# EAGLE design Power supply (EAGLE 9.6.2)
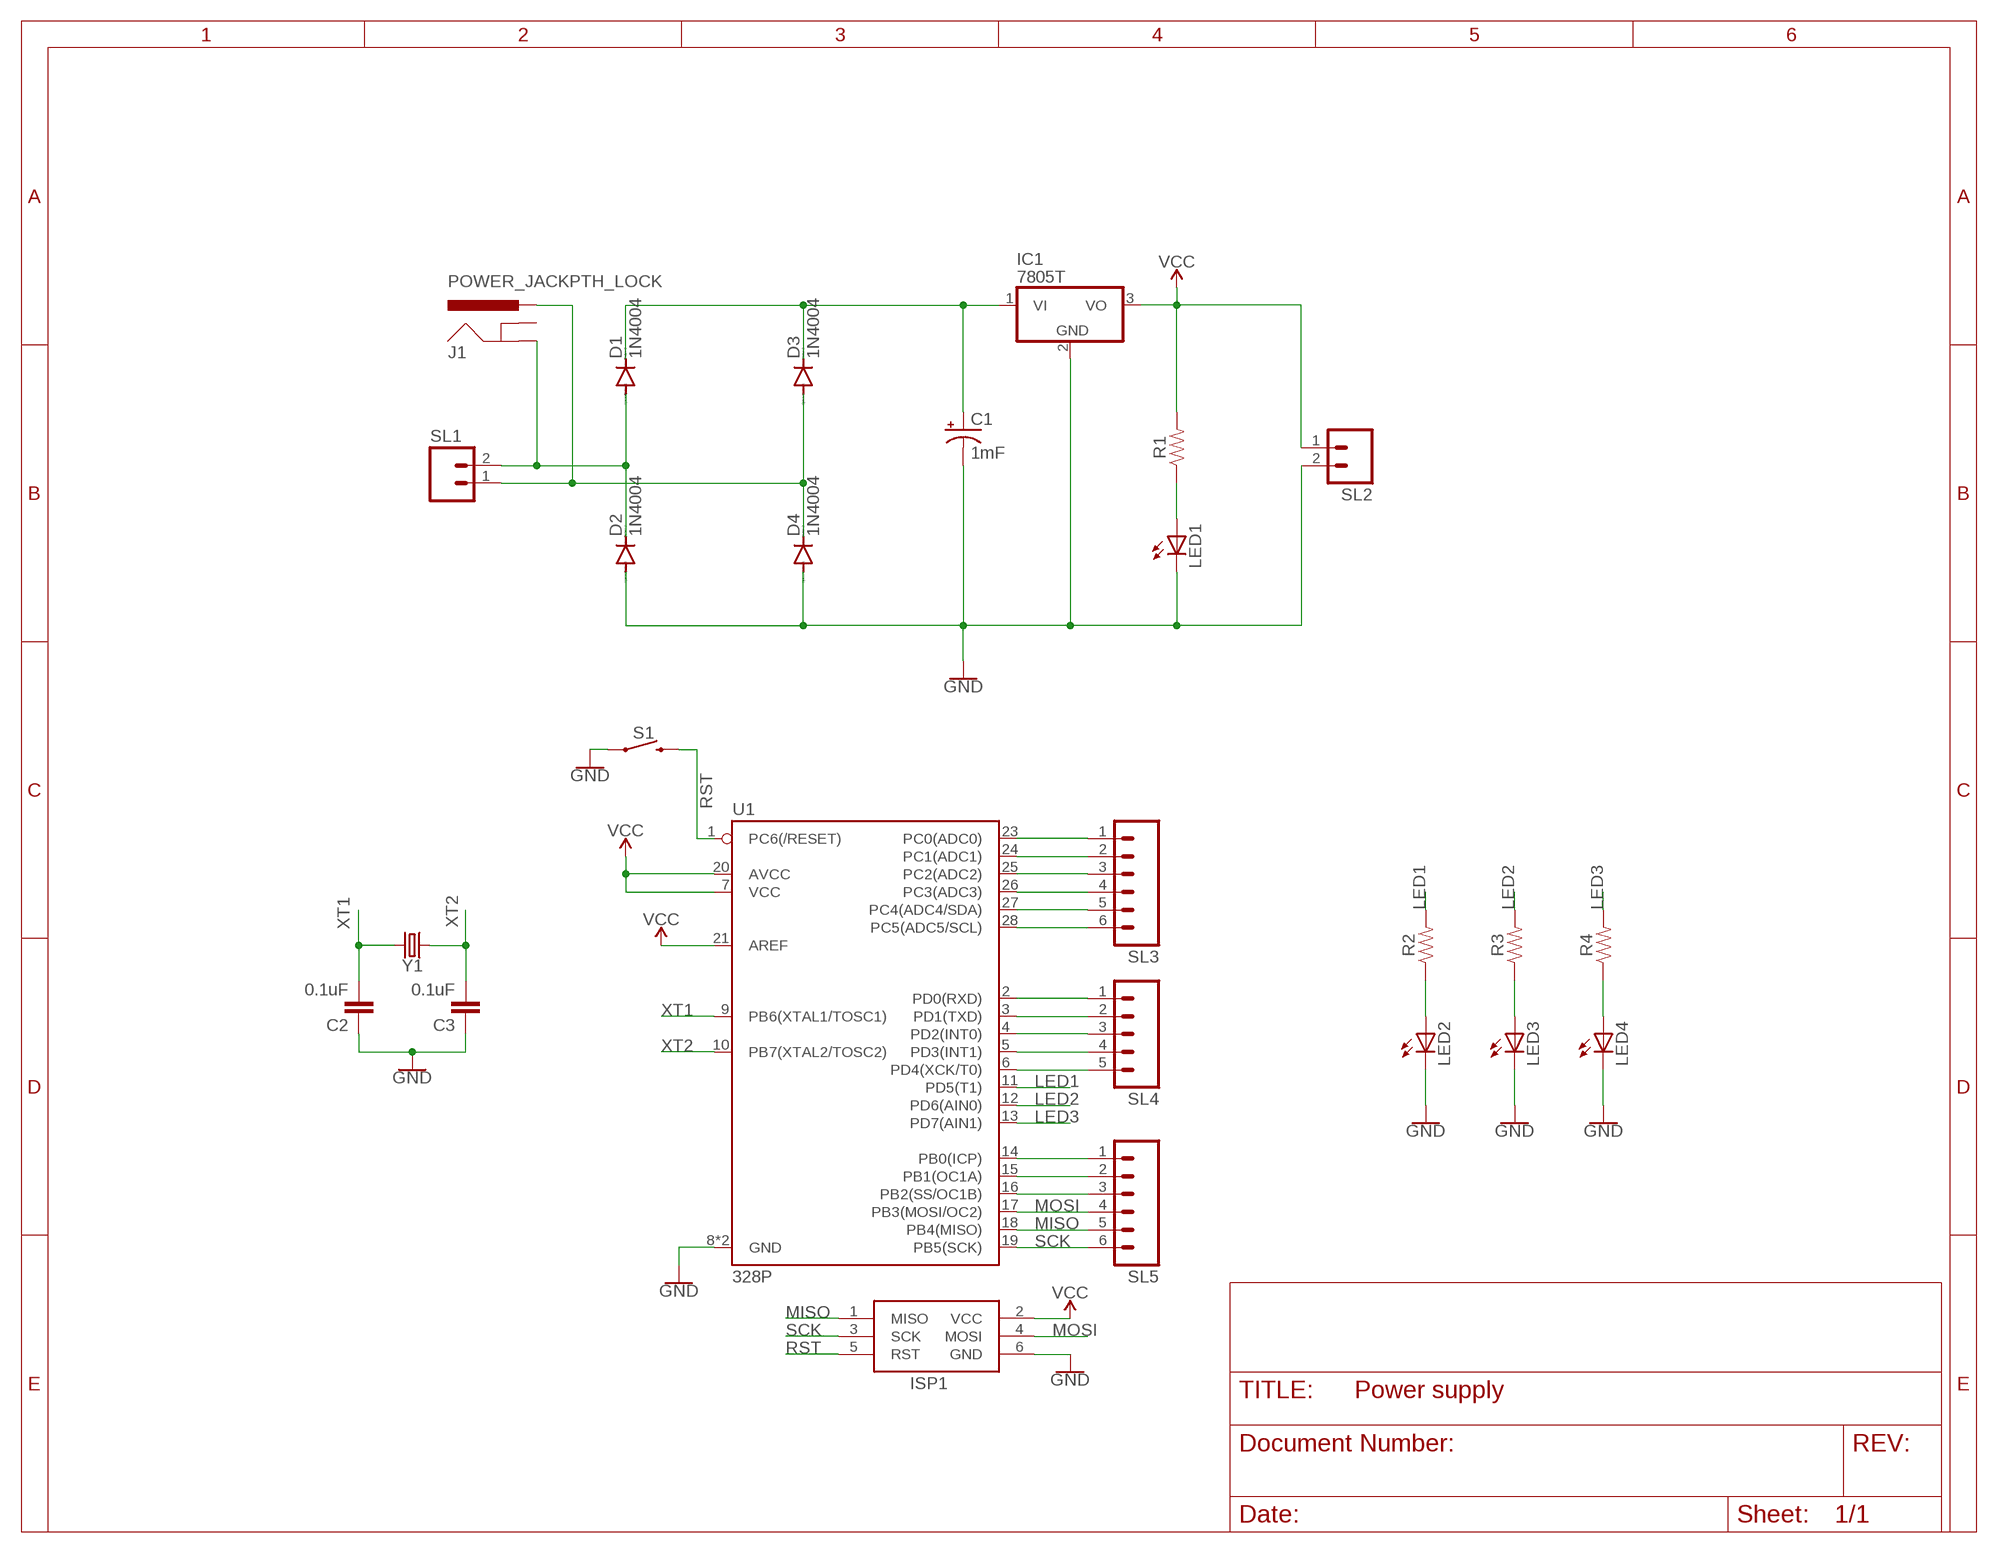
[diagram p0: schematic, sheet 1]

## Parts
C1  1mF  1000UF-RADIAL-5MM-25V-20%  [CPOL-RADIAL-5MM-10MM]
C2  0.1uF  0.1UF-KIT-EZ-50V-20%  [CAP-PTH-SMALL-KIT]
C3  0.1uF  0.1UF-KIT-EZ-50V-20%  [CAP-PTH-SMALL-KIT]
D1  1N4004  [DO41-10]
D2  1N4004  [DO41-10]
D3  1N4004  [DO41-10]
D4  1N4004  [DO41-10]
IC1  7805T  [TO220H]
ISP1  AVRISP-6  [AVRISP]
J1  POWER_JACKPTH_LOCK  [POWER_JACK_PTH_LOCK]
LED1  LED5MM  [LED5MM]
LED2  LED3MM  [LED3MM]
LED3  LED3MM  [LED3MM]
LED4  LED3MM  [LED3MM]
R1  RESISTORAXIAL-0.3  [AXIAL-0.3]
R2  RESISTORAXIAL-0.3  [AXIAL-0.3]
R3  RESISTORAXIAL-0.3  [AXIAL-0.3]
R4  RESISTORAXIAL-0.3  [AXIAL-0.3]
S1  MOMENTARY-SWITCH-SPST-PTH-6.0MM  [TACTILE_SWITCH_PTH_6.0MM]
SL1  M02  [02P]
SL2  M02  [02P]
SL3  M06  [06P]
SL4  M05  [05P]
SL5  M06  [06P]
U1  328P  ATMEGA328P_PDIP  [DIP28]
Y1  CRYSTALPTH-HC49US  [HC49US]

## Nets
GND: C1.- C2.1 C3.1 D2.A D4.A IC1.2(GND) ISP1.6(GND) LED1.K(C) LED2.K(C) LED3.K(C) LED4.K(C) S1.1 SL2.2 U1.8(GND) U1.22(GND)
LED1: R2.P$2 U1.11(PD5(T1))
LED2: R3.P$2 U1.12(PD6(AIN0))
LED3: R4.P$2 U1.13(PD7(AIN1))
MISO: ISP1.1(MISO) SL5.5 U1.18(PB4(MISO))
MOSI: ISP1.4(MOSI) SL5.4 U1.17(PB3(MOSI/OC2))
N$1: D1.A D2.C J1.GND SL1.2
N$2: D3.A D4.C J1.PWR SL1.1
N$4: C1.+ D1.C D3.C IC1.1(VI)
N$5: LED1.A R1.P$1
N$6: LED4.A R4.P$1
N$7: LED3.A R3.P$1
N$8: LED2.A R2.P$1
N$9: SL3.1 U1.23(PC0(ADC0))
N$10: SL3.2 U1.24(PC1(ADC1))
N$11: SL3.3 U1.25(PC2(ADC2))
N$12: SL3.4 U1.26(PC3(ADC3))
N$13: SL3.5 U1.27(PC4(ADC4/SDA))
N$14: SL3.6 U1.28(PC5(ADC5/SCL))
N$15: SL4.1 U1.2(PD0(RXD))
N$16: SL4.2 U1.3(PD1(TXD))
N$17: SL4.4 U1.5(PD3(INT1))
N$18: SL4.5 U1.6(PD4(XCK/T0))
N$19: SL5.1 U1.14(PB0(ICP))
N$20: SL5.2 U1.15(PB1(OC1A))
N$21: SL5.3 U1.16(PB2(SS/OC1B))
N$25: SL4.3 U1.4(PD2(INT0))
RST: ISP1.5(RST) S1.3 U1.1(PC6(/RESET))
SCK: ISP1.3(SCK) SL5.6 U1.19(PB5(SCK))
VCC: IC1.3(VO) ISP1.2(VCC) R1.P$2 SL2.1 U1.7(VCC) U1.20(AVCC) U1.21(AREF)
XT1: C2.2 U1.9(PB6(XTAL1/TOSC1)) Y1.2
XT2: C3.2 U1.10(PB7(XTAL2/TOSC2)) Y1.1
Unconnected: J1.GNDBREAK

## Library data of the parts
C1 = SparkFun-Capacitors:1000UF: 1,000µF/1mF ceramic capacitors A capacitor is a passive two-terminal electrical component used to store electrical energy temporarily in an electric field. CAP-08070; PROD_ID: CAP-09538
C2 C3 = SparkFun-Capacitors:0.1UF: 0.1µF ceramic capacitors A capacitor is a passive two-terminal electrical component used to store electrical energy temporarily in an electric field.; PROD_ID: CAP-08370
D1-D4 = diode:1N4004: DIODE general purpose rectifier, 1 A
IC1 = adafruit:78*: Positive VOLTAGE REGULATOR Added bigger pads to the TO-92 package
ISP1 = adafruit:AVRISP: AVR ISP HEADER Standard 6 pin header for AVR programming
J1 = SparkFun-Connectors:POWER_JACK: Power Jack Connector This is the standard 5.5mm barrel jack for power. The PTH is the most common, proven, reliable, footprint. The Slot footprint only works if the mill layer is transmitted to the PCB fab house so be warned. Here are the connectors we sell at SparkFun: DC Barrel Power Jack/Connector <https://www.sparkfun.com/products/119> (PRT-00119) DC Barrel Power Jack/Connector (SMD) <https://www.sparkfun.com/products/12748> (PRT-12748) DC Barrel Jack Adapter - Breadboard Compatible <https://www.sparkfun.com/products/10811> (PRT-10811) It is used on this SparkFun product (and many, many others): SparkFun RedBoard - Programmed with Arduino <https://www.sparkfun.com/products/12757> (DEV-12757) Also, if you need a mating power supply or connector, please check these out: Wall Adapter Power Supply - 9VDC 650mA <https://www.sparkfun.com/products/298> (TOL-00298) DC Barrel Jack Adapter - Male <https://www.sparkfun.com/products/10287> (PRT-10287); PROD_ID: CONN-08197; SF_ID: PRT-00119
LED1-LED4 = adafruit:LED: LED OSRAM: - CHIPLED LG R971, LG N971, LY N971, LG Q971, LY Q971, LO R971, LY R971 LH N974, LH R974 LS Q976, LO Q976, LY Q976 LO Q996 - Hyper CHIPLED LW Q18S LB Q993, LB Q99A, LB R99A - SideLED LS A670, LO A670, LY A670, LG A670, LP A670 LB A673, LV A673, LT A673, LW A673 LH A674 LY A675 LS A676, LA A676, LO A676, LY A676, LW A676 LS A679, LY A679, LG A679 - Hyper Micro SIDELED® LS Y876, LA Y876, LO Y876, LY Y876 LT Y87S - SmartLED LW L88C, LW L88S LB L89C, LB L89S, LG L890 LS L89K, LO L89K, LY L89K LS L896, LA L896, LO L896, LY L896 - TOPLED LS T670, LO T670, LY T670, LG T670, LP T670 LSG T670, LSP T670, LSY T670, LOP T670, LYG T670 LG T671, LOG T671, LSG T671 LB T673, LV T673, LT T673, LW T673 LH T674 LS T676, LA T676, LO T676, LY T676, LB T676, LH T676, LSB T676, LW T676 LB T67C, LV T67C, LT T67C, LS T67K, LO T67K, LY T67K, LW E67C LS E67B, LA E67B, LO E67B, LY E67B, LB E67C, LV E67C, LT E67C LW T67C LS T679, LY T679, LG T679 LS T770, LO T770, LY T770, LG T770, LP T770 LB T773, LV T773, LT T773, LW T773 LH T774 LS E675, LA E675, LY E675, LS T675 LS T776, LA T776, LO T776, LY T776, LB T776 LHGB T686 LT T68C, LB T68C - Hyper Mini TOPLED® LB M676 - Mini TOPLED Santana® LG M470 LS M47K, LO M47K, LY M47K Source: http://www.osram.convergy.de/
R1-R4 = SparkFun-Resistors:RESISTOR: Generic Resistor Package
S1 = SparkFun-Switches:MOMENTARY-SWITCH-SPST: Momentary Switch (Pushbutton) - SPST Normally-open (NO) SPST momentary switches (buttons, pushbuttons). Variants PTH-12MM - 12mm square, through-hole Momentary Pushbutton Switch - 12mm Square <https://www.sparkfun.com/products/9190> (COM-09190) PTH-6.0MM, PTH-6.0MM-KIT - 6.0mm square, through-hole Mini Pushbutton Switch <https://www.sparkfun.com/products/97> (COM-00097) KIT package intended for soldering kit's - only one side of pads' copper is exposed. PTH-RIGHT-ANGLE-KIT - Right-angle, through-hole Right Angle Tactile Button <https://www.sparkfun.com/products/10791> - Used on SparkFun BigTime Watch Kit <https://www.sparkfun.com/products/11734> SMD-12MM - 12mm square, surface-mount Tactile Button - SMD (12mm) <https://www.sparkfun.com/products/12993> (COM-12993) Used on SparkFun PicoBoard <https://www.sparkfun.com/products/11888> SMD-4.5MM - 4.5mm Square Trackball Switch Used on SparkFun Blackberry Trackballer Breakout <https://www.sparkfun.com/products/13169> SMD-4.6MMX2.8MM - 4.60mm x 2.80mm, surface mount Used on SparkFun Pro Micro - RP2040 <https://www.sparkfun.com/products/17717> SMD-5.2MM, SMD-5.2-REDUNDANT - 5.2mm square, surface-mount Mini Pushbutton Switch - SMD <https://www.sparkfun.com/products/8720> (COM-08720) Used on Arduino Pro Mini <https://www.sparkfun.com/products/11114> REDUNDANT package connects both switch circuits together SMD-6.0X3.5MM - 6.0 x 3.5mm, surface mount Momentary Reset Switch SMD <https://www.sparkfun.com/products/8229> (COM-08229) SMD-6.2MM-TALL - 6.2mm square, surface mount Tactile Button - SMD (6mm) <https://www.sparkfun.com/products/12992> Used on SparkFun Digital Sandbox <https://www.sparkfun.com/products/12651> SMD-RIGHT-ANGLE - Right-angle, surface mount Used on SparkFun Block for Intel® Edison - Arduino <https://www.sparkfun.com/products/13036>; PROD_ID: SWCH-08441; SF_SKU: COM-00097
SL1 SL2 = con-amp-quick:M02: AMP QUICK CONNECTOR; OC_FARNELL: unknown; OC_NEWARK: unknown
SL3 SL5 = con-amp-quick:M06: AMP QUICK CONNECTOR; OC_FARNELL: unknown; OC_NEWARK: unknown
SL4 = con-amp-quick:M05: AMP QUICK CONNECTOR; OC_FARNELL: unknown; OC_NEWARK: unknown
U1 = SparkFun-IC-Microcontroller:ATMEGA328P_PDIP: Atmel 328P Through hole ATMEGA328P uC used in the Arduino 32kb flash, 1k EEPROM, 2k SRAM Datasheet <http://www.sparkfun.com/datasheets/Components/SMD/ATMega328.pdf> SparkFun Products Storefront component: AVR 28 Pin 20MHz 32K 6A/D - ATMega328P <https://www.sparkfun.com/products/9061> (COM-09061) SparkFun Simon Says - Through-Hole Soldering Kit <https://www.sparkfun.com/products/10547> (KIT-10547) SparkFun Learn to Solder - Simon Says <https://www.sparkfun.com/products/13708> (KIT-13708) SparkFun BigTime Watch Kit <https://www.sparkfun.com/products/11734> (KIT-11734) SparkFun ClockIt <https://www.sparkfun.com/products/10930> (KIT-10930) SparkFun Serial Enabled LCD Kit <https://www.sparkfun.com/products/10097> (LCD-10097) SparkFun Simon Tilts - Through Hole Soldering Kit <https://www.sparkfun.com/products/12634> (KIT-12634) SparkFun Frequency Counter Kit <https://www.sparkfun.com/products/10140> (KIT-10140) FabFM Radio Kit <https://www.sparkfun.com/products/11043> (KIT-11043) SparkFun Binary Blaster Kit <https://www.sparkfun.com/products/12037> (KIT-12037) SparkFun Metro-Gnome <https://www.sparkfun.com/products/9236> (KIT-09236) ATmega328 with Arduino Optiboot (Uno) <https://www.sparkfun.com/products/10524> (DEV-10524); PROD_ID: IC-09136
Y1 = SparkFun-Clocks:CRYSTAL: Crystals (Generic) These are passive quartz crystals, which can be used as a clock source for a microcontroller. Crystal's are two-terminal devices. They require external "load" capacitors to generate an oscillating signal.

## Board
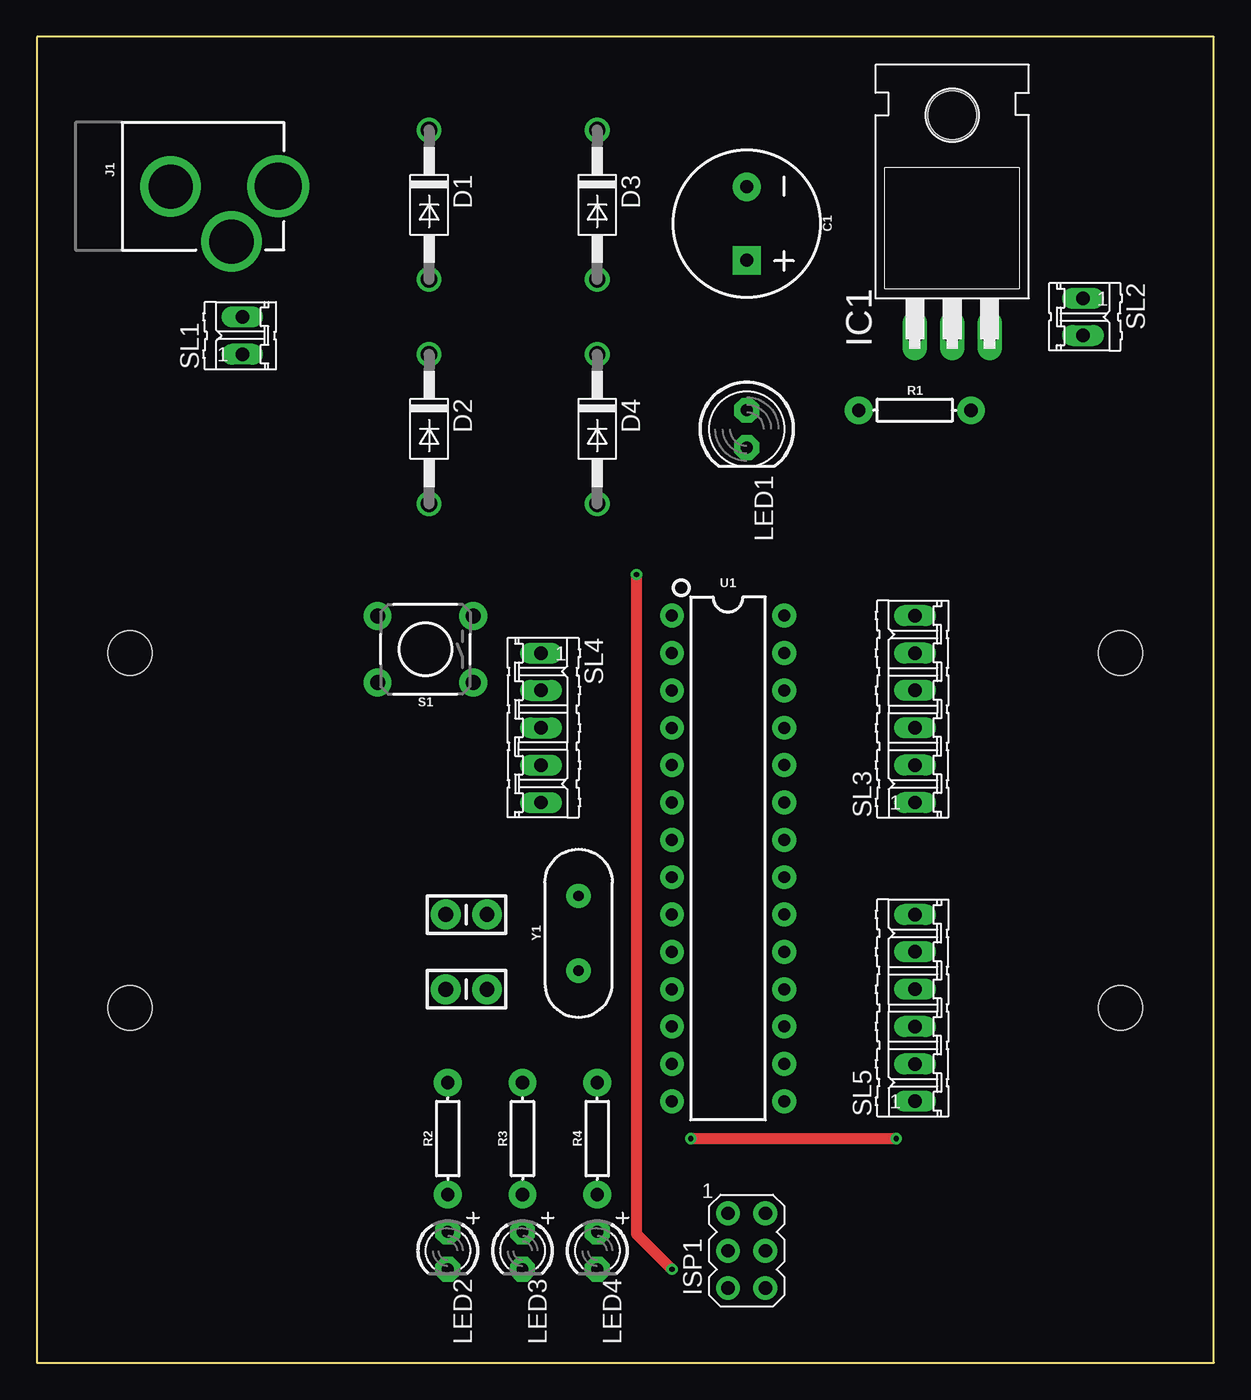
[diagram p1: board, top side]
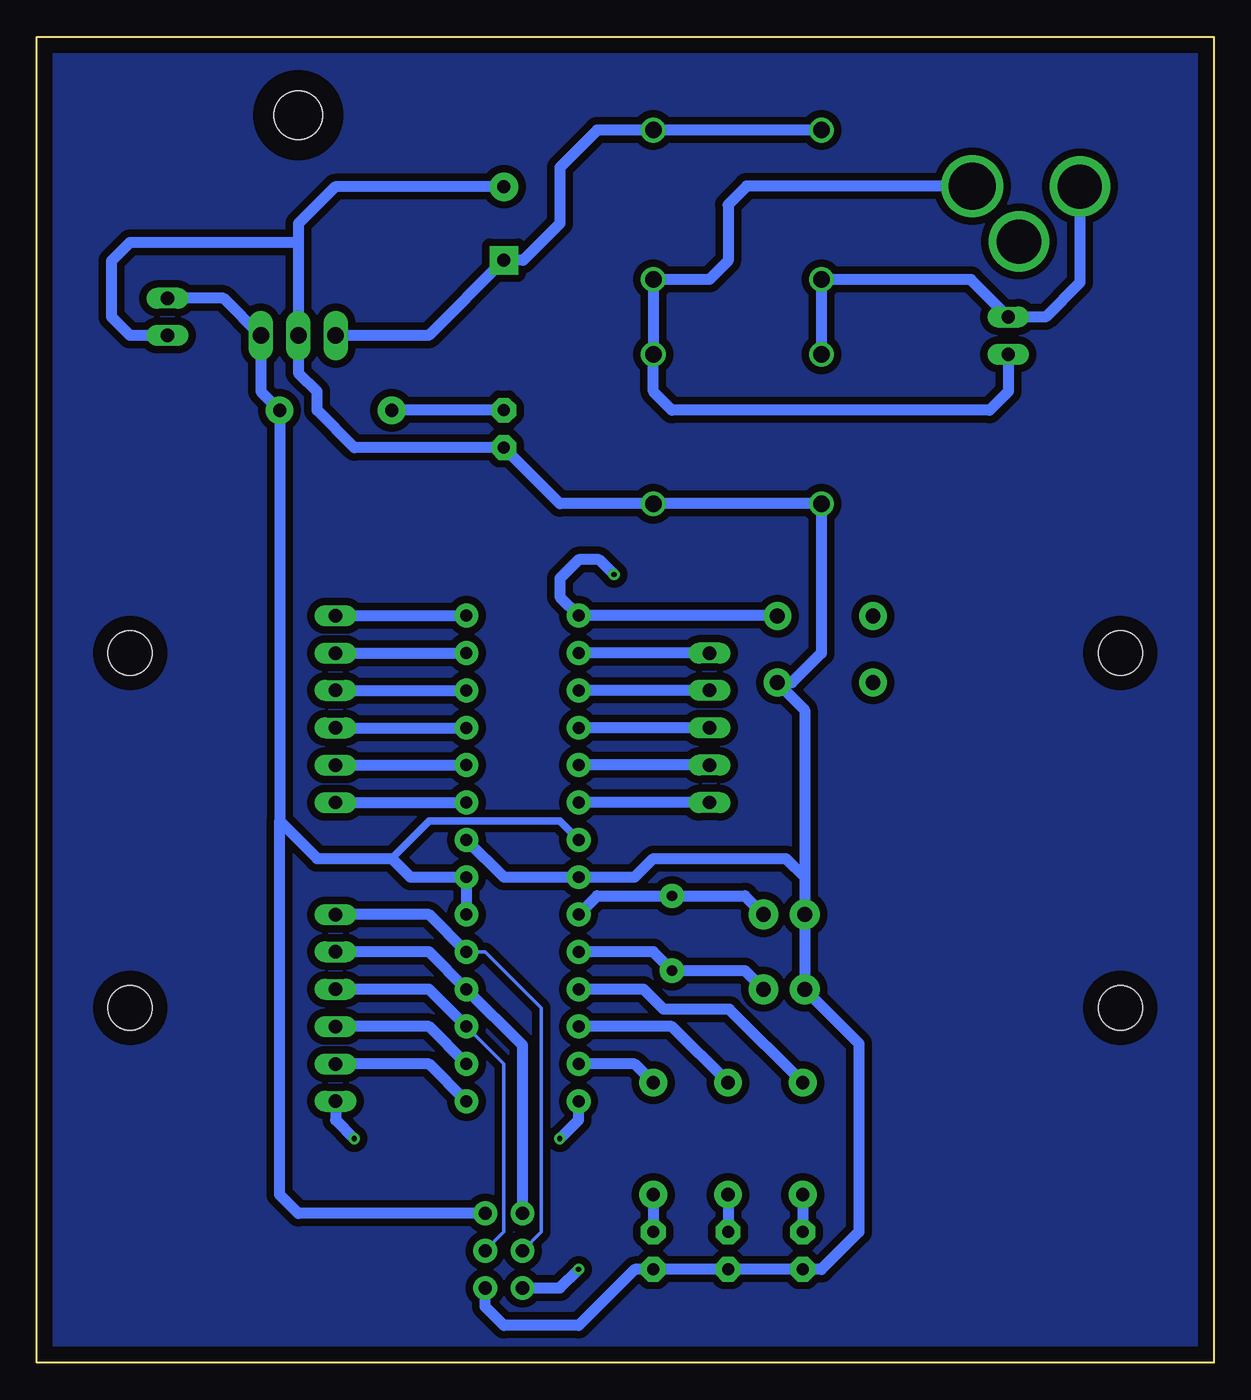
[diagram p2: board, bottom side, seen from below]

Size 80.01 x 90.17 mm. Coordinates in mm from the lower left corner, seen from the top.
Outline: 0,90.17 0,0 80.01,0 80.01,90.17 0,90.17
Copper layers (1*16): Top 0.035mm / dielectric 1.5mm / Bottom 0.035mm
Design rules "default": minimum track width 6mil, minimum drill 0.35mm, track to track 6mil, track to pad 6mil, pad to pad 6mil, via to via 6mil, smd to smd 6mil, copper to edge 40mil, drill to drill 6mil, minimum pad ring 10mil, minimum via ring 8mil, stop-mask expansion 4mil, vias tented up to drill 0mil, thermal gap 10mil
Holes 3 mm at 6.35,48.26 6.35,24.13 73.66,24.13 73.66,48.26

### Footprints (pad centres in the part's own frame; a part is rotated, then mirrored left to right if it is on the bottom)
CPOL-RADIAL-5MM-10MM = drill 0.9 pad 1.93 square: + 2.5,0 | drill 0.9 pad 1.93: - -2.5,0
CAP-PTH-SMALL-KIT = drill 1.016 pad 2.032: 1 -1.397,0; 2 1.397,0
DO41-10 = drill 1.118: A 5.08,0; C -5.08,0
TO220H = drill 1.118 long: 1 -2.54,-10.16; 2 0,-10.16; 3 2.54,-10.16 | hole 3.302: 0,4.826
AVRISP = drill 0.9 pad 1.626: 1 -1.27,2.54; 2 1.27,2.54; 3 -1.27,0; 4 1.27,0; 5 -1.27,-2.54; 6 1.27,-2.54
POWER_JACK_PTH_LOCK = drill 2.997 pad 4.115: GND 0.025,6.557; GNDBREAK 3.762,10.7 | drill 3.2 pad 4.115: PWR 0,13.878
LED5MM = drill 0.813 pad 1.676 octagon: A -1.27,0; K 1.27,0
LED3MM = drill 0.813 pad 1.676 octagon: A -1.27,0; K 1.27,0
AXIAL-0.3 = drill 0.9 pad 1.88: P$1 -3.81,0; P$2 3.81,0
TACTILE_SWITCH_PTH_6.0MM = drill 1.016 pad 1.88: 1 -3.251,2.261; 2 3.251,2.261; 3 -3.251,-2.261; 4 3.251,-2.261
02P = drill 0.914 long: 1 -1.27,0; 2 1.27,0
06P = drill 0.914 long: 1 -6.35,0; 2 -3.81,0; 3 -1.27,0; 4 1.27,0; 5 3.81,0; 6 6.35,0
05P = drill 0.914 long: 1 -5.08,0; 2 -2.54,0; 3 0,0; 4 2.54,0; 5 5.08,0
DIP28 = drill 0.813 pad 1.626: 1 -16.51,-3.81; 2 -13.97,-3.81; 3 -11.43,-3.81; 4 -8.89,-3.81; 5 -6.35,-3.81; 6 -3.81,-3.81; 7 -1.27,-3.81; 8 1.27,-3.81; 9 3.81,-3.81; 10 6.35,-3.81; 11 8.89,-3.81; 12 11.43,-3.81; 13 13.97,-3.81; 14 16.51,-3.81; 15 16.51,3.81; 16 13.97,3.81; 17 11.43,3.81; 18 8.89,3.81; 19 6.35,3.81; 20 3.81,3.81; 21 1.27,3.81; 22 -1.27,3.81; 23 -3.81,3.81; 24 -6.35,3.81; 25 -8.89,3.81; 26 -11.43,3.81; 27 -13.97,3.81; 28 -16.51,3.81
HC49US = drill 0.7 pad 1.651: 1 -2.54,0; 2 2.54,0

### Placement (x,y rotation side)
C1  48.26,77.47 270 top
C2  29.21,30.48 0 top
C3  29.21,25.4 0 top
D1  26.67,78.74 270 top
D2  26.67,63.5 270 top
D3  38.1,78.74 270 top
D4  38.1,63.5 270 top
IC1  62.23,80.01 0 top
ISP1  48.26,7.62 0 top
J1  2.54,80.01 270 top
LED1  48.26,63.5 270 top
LED2  27.94,7.62 270 top
LED3  33.02,7.62 270 top
LED4  38.1,7.62 270 top
R1  59.69,64.77 0 top
R2  27.94,15.24 90 top
R3  33.02,15.24 90 top
R4  38.1,15.24 90 top
S1  26.42,48.51 180 top
SL1  13.97,69.85 90 top
SL2  71.12,71.12 270 top
SL3  59.69,44.45 90 top
SL4  34.29,43.18 270 top
SL5  59.69,24.13 90 top
U1  46.99,34.29 270 top
Y1  36.83,29.21 90 top

### Tracks (layer width: path | path; a pad name or v marks a point on that pad's centre or on a via)
GND
  Bottom 0.762: C1.- 59.73,79.97 62.23,77.47 62.23,76.2 | 62.23,76.2 IC1.2 62.23,67.31 60.96,66.04 60.96,64.77 58.42,62.23 LED1.K 44.45,58.42 D4.A D2.A 26.67,48.26 28.68,46.25 S1.1 27.81,44.4 27.81,33.02 | ISP1.6 49.53,3.81 48.26,2.54 43.18,2.54 39.37,6.35 LED4.K LED3.K LED2.K 26.67,6.35 24.13,8.89 24.13,21.72 C3.1 C2.1 27.81,33.02 | SL2.2 73.66,69.85 74.93,71.12 74.93,74.93 73.66,76.2 62.23,76.2 | 27.81,33.02 29.08,34.29 38.1,34.29 39.37,33.02 U1.8 48.26,33.02 U1.22
LED1
  Bottom 0.762: U1.11 38.75,25.4 37.39,24.04 32.93,24.04 R2.P$2
LED2
  Bottom 0.762: R3.P$2 36.83,22.86 U1.12
LED3
  Bottom 0.762: R4.P$2 39.37,20.32 U1.13
MISO
  Bottom 0.762: SL5.5 53.34,27.94 U1.18 46.99,21.59 ISP1.1
MOSI
  Bottom 0.254: ISP1.4 48.26,8.89 48.26,20.32 U1.17
  Bottom 0.762: U1.17 53.34,25.4 SL5.4
N$1
  Bottom 0.762: D2.C D1.A 16.51,73.66 SL1.2 11.43,71.12 9.1,73.45 J1.GND
N$2
  Bottom 0.762: J1.PWR 31.75,80.01 33.02,78.74 33.02,74.93 34.29,73.66 D3.A D4.C 38.1,66.04 36.83,64.77 15.24,64.77 13.97,66.04 SL1.1
N$3
  pour Bottom (isolate 0.508): 0,90.17 0,0 80.01,0 80.01,90.17
N$4
  Bottom 0.762: D1.C D3.C 41.91,83.82 44.45,81.28 44.45,77.47 46.95,74.97 C1.+ 53.38,69.85 IC1.1
N$5
  Bottom 0.762: LED1.A R1.P$1
N$6
  Bottom 0.762: R4.P$1 LED4.A
N$7
  Bottom 0.762: R3.P$1 LED3.A
N$8
  Bottom 0.762: R2.P$1 LED2.A
N$9
  Bottom 0.762: SL3.1 U1.23
N$10
  Bottom 0.762: SL3.2 U1.24
N$11
  Bottom 0.762: SL3.3 U1.25
N$12
  Bottom 0.762: SL3.4 U1.26
N$13
  Bottom 0.762: SL3.5 U1.27
N$14
  Bottom 0.762: SL3.6 U1.28
N$15
  Bottom 0.762: SL4.1 U1.2
N$16
  Bottom 0.762: SL4.2 U1.3
N$17
  Bottom 0.762: SL4.4 U1.5
N$18
  Bottom 0.762: SL4.5 U1.6
N$19  (via drill 0.35)
  Top 0.762: v58.42,15.24 v44.45,15.24
  Bottom 0.762: SL5.1 59.69,16.51 v58.42,15.24 | v44.45,15.24 43.18,16.51 U1.14
N$20
  Bottom 0.762: U1.15 53.34,20.32 SL5.2
N$21
  Bottom 0.762: U1.16 53.34,22.86 SL5.3
N$25
  Bottom 0.762: SL4.3 U1.4
RST  (via drill 0.35)
  Top 0.762: v43.18,6.35 40.77,8.76 v40.77,53.59
  Bottom 0.762: S1.3 29.69,50.8 U1.1 44.45,52.07 44.45,53.34 43.18,54.61 41.78,54.61 v40.77,53.59 | ISP1.5 44.45,5.08 v43.18,6.35
SCK
  Bottom 0.254: ISP1.3 45.72,8.89 45.72,24.13 49.53,27.94 U1.19
  Bottom 0.762: U1.19 53.34,30.48 SL5.6
VCC
  Bottom 0.508: U1.7 44.45,36.83 53.34,36.83 55.88,34.29
  Bottom 0.762: SL2.1 67.31,72.39 IC1.3 64.77,66.04 R1.P$2 63.5,36.83 | U1.20 U1.21 54.61,33.02 55.88,34.29 60.96,34.29 63.5,36.83 | 63.5,36.83 63.5,11.43 62.23,10.16 ISP1.2
XT1
  Bottom 0.762: U1.9 41.91,31.75 Y1.2 31.88,31.75 C2.2
XT2
  Bottom 0.762: U1.10 38.1,27.94 Y1.1 31.88,26.67 C3.2